# EAGLE design PCB 3.0 (EAGLE 9.6.2)
CNAME: DIY-Thermocam V2; CREVISION: 2.3; DESIGNER: Max Ritter
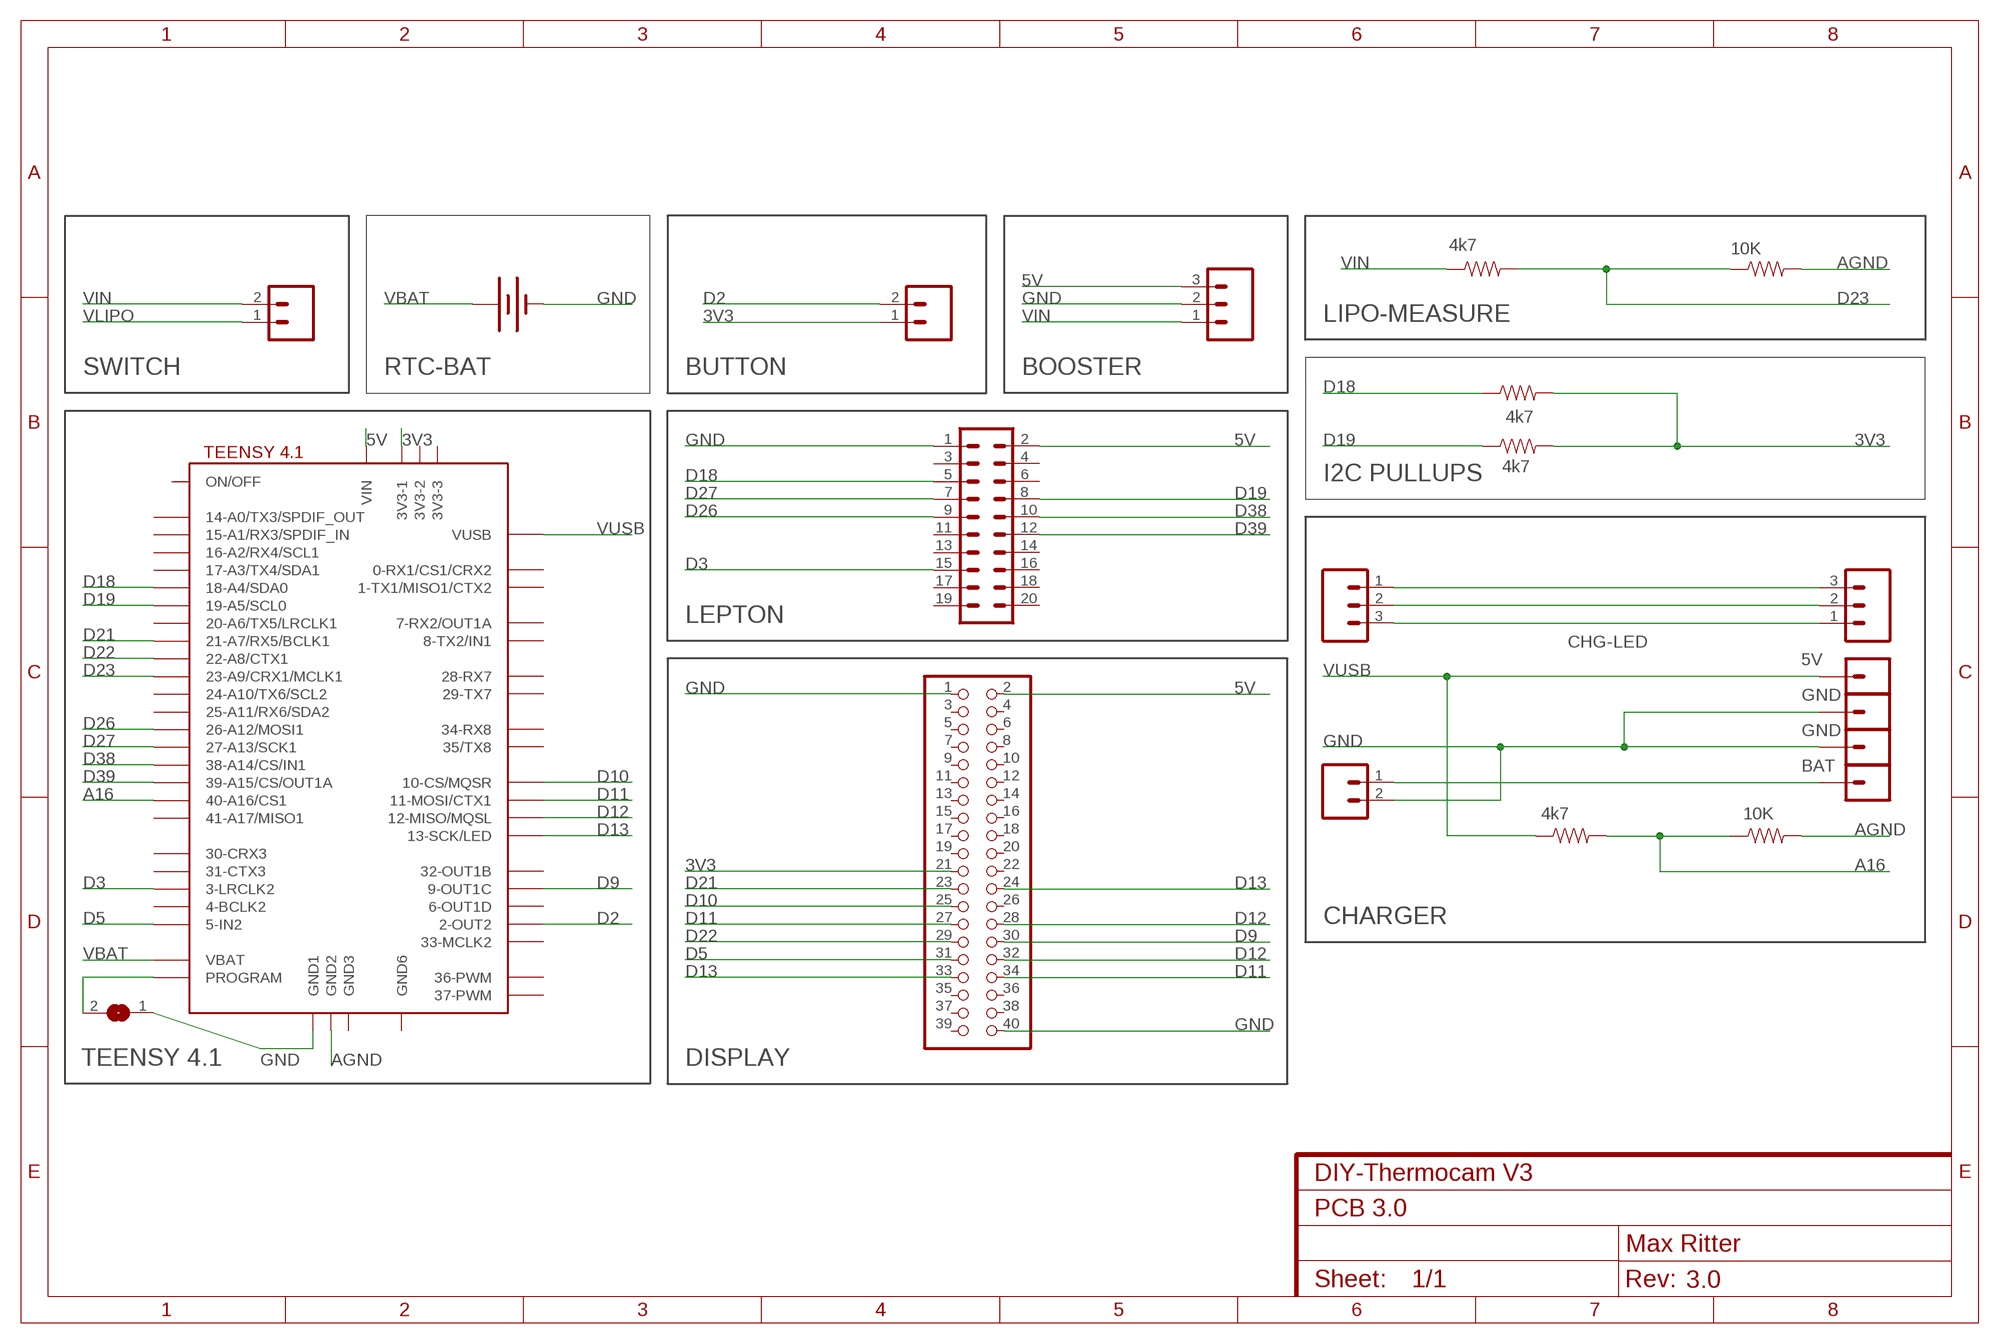
[diagram p0: schematic, sheet 1]
FRAME1 (FRAME-A4L): CNAME: DIY-Thermocam V3; CREVISION: 3.0

## Parts
BAT  BATTERY12PTH  [BATTCON_12MM_PTH]
BOOSTER  M03PTH  [1X03]
BUTTON  M02PTH  [1X02]
BUTTON1  M02PTH  [1X02]
CHG-LED  M03PTH  [1X03]
J2  CONN_10X2NOSILK  [2X10_NOSILK]
JP1  M01PTH  [1X01]
JP2  M01PTH  [1X01]
JP3  M01PTH  [1X01]
JP4  M01PTH  [1X01]
LASER1  M03PTH  [1X03]
LCD-HEADER  PINHD-2X20  [2X20]
PROGRAM  SJ  [SJ]
R1  4k7  RESISTORPTH-1/4W  [AXIAL-0.4]
R2  10K  RESISTORPTH-1/4W  [AXIAL-0.4]
R3  4k7  RESISTORPTH-1/4W  [AXIAL-0.4]
R4  4k7  RESISTORPTH-1/4W  [AXIAL-0.4]
R5  10K  RESISTORPTH-1/4W  [AXIAL-0.4]
R6  4k7  RESISTORPTH-1/4W  [AXIAL-0.4]
SWITCH  M02PTH  [1X02]
U$2  TEENSY41-E  [TENNSY41-E]

## Nets
3V3: BUTTON.1 LCD-HEADER.21 R4.P$2 R6.P$2 U$2.3V3-1
5V: BOOSTER.3 J2.2 LCD-HEADER.2 U$2.VIN
A16: R3.P$2 R5.P$1 U$2.40-A16/CS1
AGND: R2.P$2 R5.P$2 U$2.GND2
D2: BUTTON.2 U$2.2-OUT2
D3: J2.15 U$2.3-LRCLK2
D5: LCD-HEADER.31 U$2.5-IN2
D9: LCD-HEADER.30 U$2.9-OUT1C
D10: LCD-HEADER.25 U$2.10-CS\MQSR(10-CS/MQSR)
D11: LCD-HEADER.27 LCD-HEADER.34 U$2.11-MOSI/CTX1
D12: LCD-HEADER.28 LCD-HEADER.32 U$2.12-MISO/MQSL
D13: LCD-HEADER.24 LCD-HEADER.33 U$2.13-SCK/LED
D18: J2.5 R4.P$1 U$2.18-A4/SDA0
D19: J2.8 R6.P$1 U$2.19-A5/SCL0
D21: LCD-HEADER.23 U$2.21-A7/RX5/BCLK1
D22: LCD-HEADER.29 U$2.22-A8/CTX1
D23: R1.P$2 R2.P$1 U$2.23-A9/CRX1/MCLK1
D26: J2.9 U$2.26-A12/MOSI1
D27: J2.7 U$2.27-A13/SCK1
D38: J2.10 U$2.38-A14/CS/IN1
D39: J2.12 U$2.39-A15/CS/OUT1A
GND: BAT.GND(-) BOOSTER.2 BUTTON1.2 J2.1 JP1.1 JP2.1 LCD-HEADER.1 LCD-HEADER.40 PROGRAM.1 U$2.GND1
N$4: CHG-LED.3 LASER1.1
N$16: CHG-LED.2 LASER1.2
N$18: CHG-LED.1 LASER1.3
N$42: PROGRAM.2 U$2.PROGRAM
VBAT: BAT.VCC@1(+) U$2.VBAT
VIN: BOOSTER.1 R1.P$1 SWITCH.2
VLIPO: BUTTON1.1 JP3.1 SWITCH.1
VUSB: JP4.1 R3.P$1 U$2.VUSB
Unconnected: J2.3 J2.4 J2.6 J2.11 J2.13 J2.14 J2.16 J2.17 J2.18 J2.19 J2.20 LCD-HEADER.3 LCD-HEADER.4 LCD-HEADER.5 LCD-HEADER.6 LCD-HEADER.7 LCD-HEADER.8 LCD-HEADER.9 LCD-HEADER.10 LCD-HEADER.11 LCD-HEADER.12 LCD-HEADER.13 LCD-HEADER.14 LCD-HEADER.15 LCD-HEADER.16 LCD-HEADER.17 LCD-HEADER.18 LCD-HEADER.19 LCD-HEADER.20 LCD-HEADER.22 LCD-HEADER.26 LCD-HEADER.35 LCD-HEADER.36 LCD-HEADER.37 LCD-HEADER.38 LCD-HEADER.39 U$2.0-RX1/CS1/CRX2 U$2.1-TX1/MISO1/CTX2 U$2.3V3-2 U$2.3V3-3 U$2.4-BCLK2 U$2.6-OUT1D U$2.7-RX2/OUT1A U$2.8-TX2/IN1 U$2.14-A0/TX3/SPDIF_OUT U$2.15-A1/RX3/SPDIF_IN U$2.16-A2/RX4/SCL1 U$2.17-A3/TX4/SDA1 U$2.20-A6/TX5/LRCLK1 U$2.24-A10/TX6/SCL2 U$2.25-A11/RX6/SDA2 U$2.28-RX7 U$2.29-TX7 U$2.30-CRX3 U$2.31-CTX3 U$2.32-OUT1B U$2.33-MCLK2 U$2.34-RX8 U$2.35-TX8(35/TX8) U$2.36-PWM U$2.37-PWM U$2.41-A17/MISO1 U$2.GND3 U$2.GND6 U$2.ON/OFF

## Notes on the sheet
- LIPO-MEASURE
- SWITCH | RTC-BAT | BUTTON | BOOSTER
- I2C PULLUPS
- LEPTON
- 5V
- GND
- GND
- BAT
- CHARGER
- TEENSY 4.1 | DISPLAY

## Library data of the parts
BAT = SparkFun-Electromechanical:BATTERY: Battery Holders Various common sizes : AA, AAA, 18650 (PRT-12895), 20mm coin cell and 12mm coin cell. 20MM_4LEGS, BATT-10373
BOOSTER CHG-LED LASER1 = SparkFun-Connectors:M03: Header 3 Standard 3-pin 0.1" header. Use with straight break away headers (SKU : PRT-00116), right angle break away headers (PRT-00553), swiss pins (PRT-00743), machine pins (PRT-00117), and female headers (PRT-00115). Molex polarized connector foot print use with SKU : PRT-08232 with associated crimp pins and housings.
BUTTON BUTTON1 SWITCH = SparkFun-Connectors:M02: Standard 2-pin 0.1" header. Use with - straight break away headers ( PRT-00116) - right angle break away headers (PRT-00553) - swiss pins (PRT-00743) - machine pins (PRT-00117) - female headers (PRT-00115) Molex polarized connector foot print use with: PRT-08233 with associated crimp pins and housings. 2.54_SCREWTERM for use with PRT-10571. 3.5mm Screw Terminal footprints for PRT-08084 5mm Screw Terminal footprints for use with PRT-08432
J2 = SparkFun-Connectors:CONN_10X2: Multi connection point. Often used as Generic Header-pin footprint for 0.1 inch spaced/style header connections On any of the 0.1 inch spaced packages, you can populate with these: Break Away Headers - Straight <https://www.sparkfun.com/products/116> (PRT-00116) Break Away Male Headers - Right Angle <https://www.sparkfun.com/products/553> (PRT-00553) Female Headers <https://www.sparkfun.com/products/115> (PRT-00115) Break Away Headers - Machine Pin <https://www.sparkfun.com/products/117> (PRT-00117) Break Away Female Headers - Swiss Machine Pin <https://www.sparkfun.com/products/743> (PRT-00743) Special note about the "SPECIAL" package: This was SPECIALLY designed to be used with our Graphic LCD Backpack. Be sure you want to use this! It is not only staggered on each line of header holes, but IT IS ALSO offset of the center point of the top and bottom lines by 5 mil. This causes the headers to lock into place on the "standard" footprint on the LCD screen. The extra squares on the tdocu layer are there simply to reference other pins (if you were to actually populate a longer header than ten long - this is what we do with the backpacks).
JP1-JP4 = SparkFun-Connectors:M01: Header 1 Standard 1-pin 0.1" header. Use with straight break away headers (SKU : PRT-00116), right angle break away headers (PRT-00553), swiss pins (PRT-00743), machine pins (PRT-00117), and female headers (PRT-00115).
LCD-HEADER = pinhead:PINHD-2X20: PIN HEADER
PROGRAM = jumper:SJ: SMD solder JUMPER
R1-R6 = SparkFun-Resistors:RESISTOR: Resistor Basic schematic elements and footprints for 0603, 1206, and PTH resistors.
U$2 = teensy:TEENSY41-E

## Board
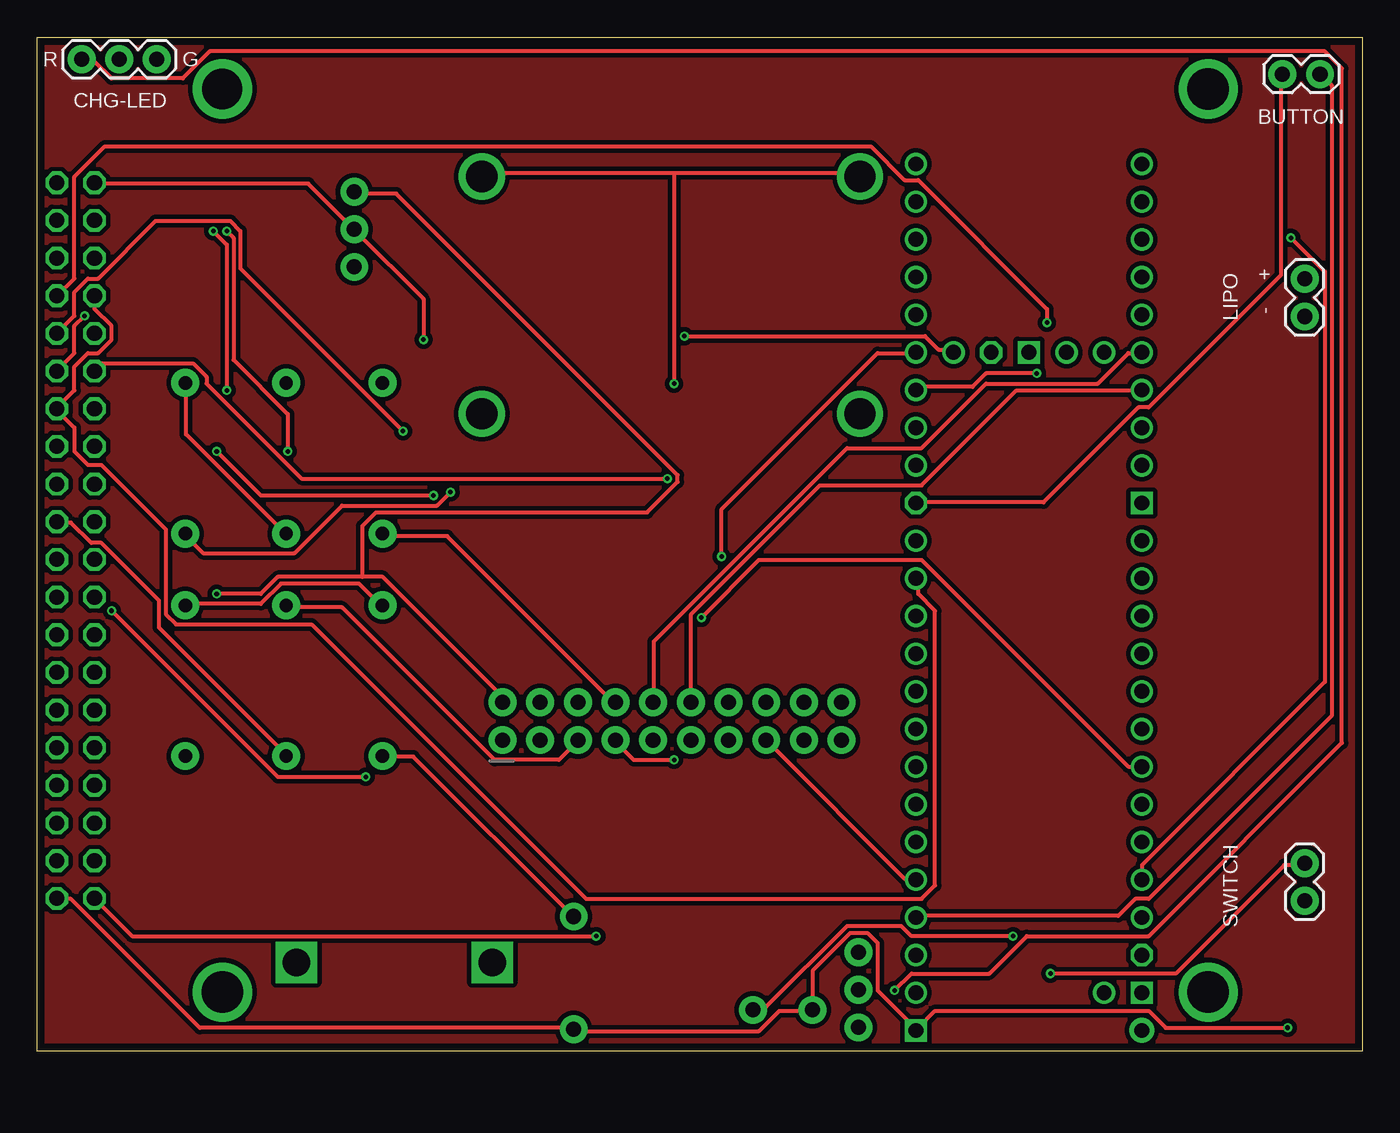
[diagram p1: board, top side]
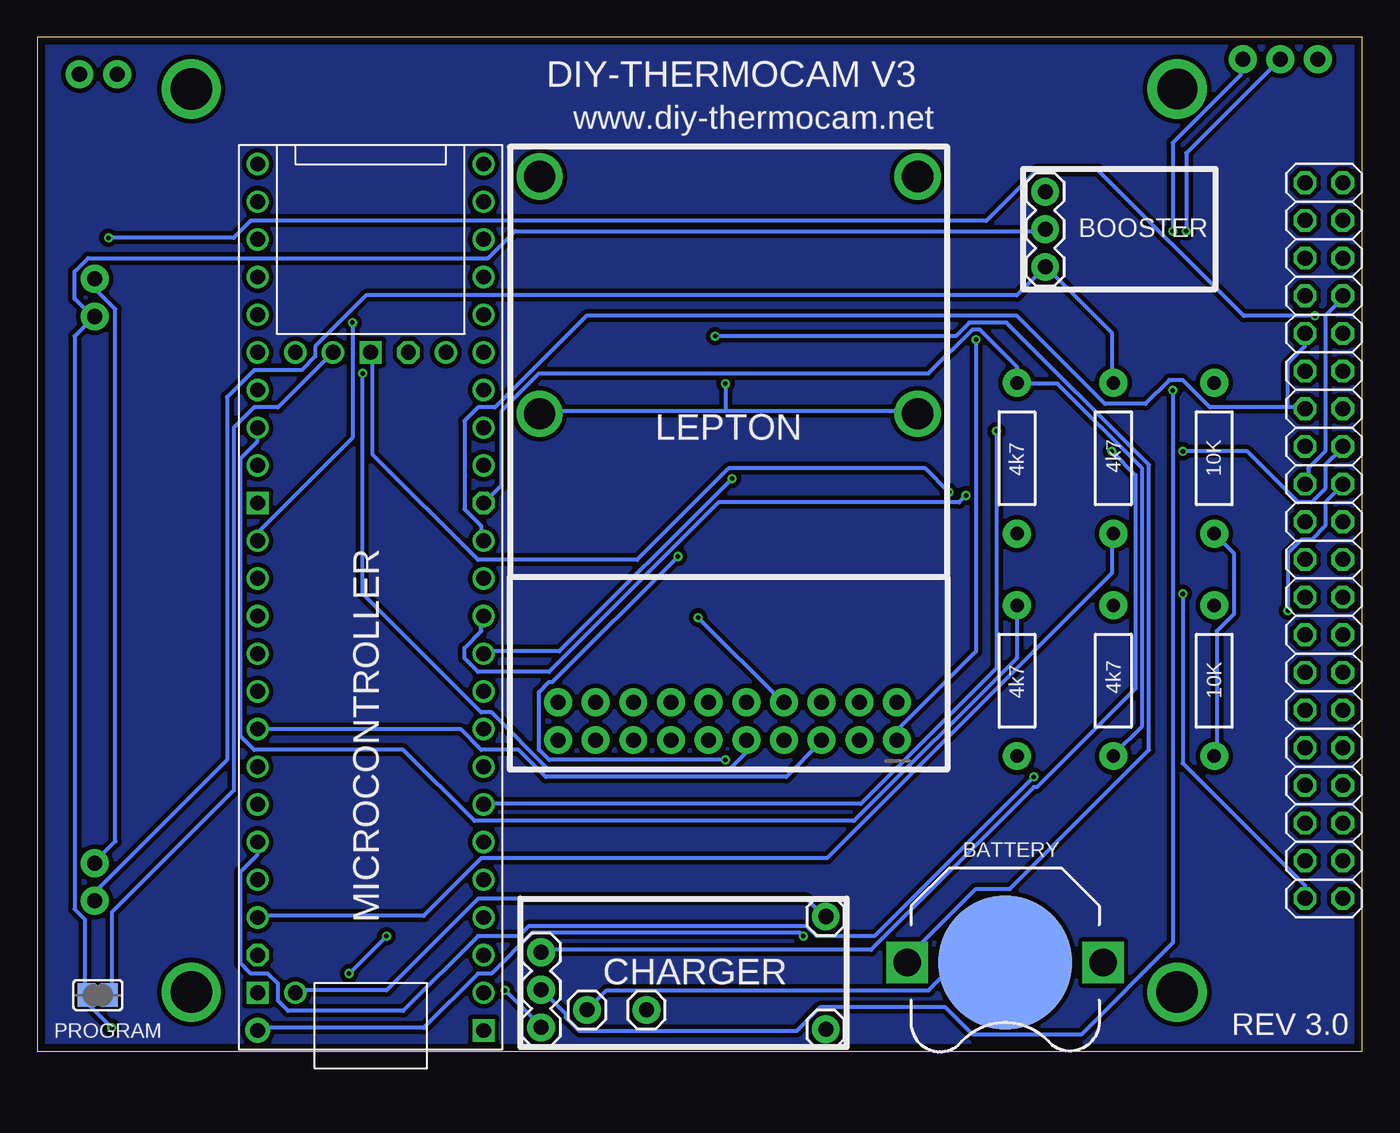
[diagram p2: board, bottom side, seen from below]

Size 89.4 x 68.4 mm. Coordinates in mm from the lower left corner, seen from the top.
Outline: 89.4,0 0,0 0,68.4 89.4,68.4 89.4,0
Copper layers (1*16): Top 0.035mm / dielectric 1.5mm / Bottom 0.035mm
Design rules "NOA Eagle Rule 2016-06-12 *": minimum track width 10mil, minimum drill 12mil, track to track 8mil, track to pad 8mil, pad to pad 8mil, via to via 8mil, smd to smd 0mil, copper to edge 20mil, drill to drill 10mil, minimum pad ring 10mil, minimum via ring 6mil, stop-mask expansion 2mil, vias tented up to drill 25mil, thermal gap 10mil

### Footprints (pad centres in the part's own frame; a part is rotated, then mirrored left to right if it is on the bottom)
BATTCON_12MM_PTH = smd 9 x 9: GND 0,0 | drill 1.854 square: VCC@1 6.604,0; VCC@2 -6.604,0
1X03 = drill 1.016 pad 1.88: 1 0,0; 2 2.54,0; 3 5.08,0
1X02 = drill 1.016 pad 1.88: 1 0,0; 2 2.54,0
2X10_NOSILK = drill 1.016 pad 1.88: 1 0,0; 2 0,2.54; 3 2.54,0; 4 2.54,2.54; 5 5.08,0; 6 5.08,2.54; 7 7.62,0; 8 7.62,2.54; 9 10.16,0; 10 10.16,2.54; 11 12.7,0; 12 12.7,2.54; 13 15.24,0; 14 15.24,2.54; 15 17.78,0; 16 17.78,2.54; 17 20.32,0; 18 20.32,2.54; 19 22.86,0; 20 22.86,2.54
1X01 = drill 1.016 pad 1.88: 1 0,0
2X20 = drill 1.016 octagon: 1 -24.13,-1.27; 2 -24.13,1.27; 3 -21.59,-1.27; 4 -21.59,1.27; 5 -19.05,-1.27; 6 -19.05,1.27; 7 -16.51,-1.27; 8 -16.51,1.27; 9 -13.97,-1.27; 10 -13.97,1.27; 11 -11.43,-1.27; 12 -11.43,1.27; 13 -8.89,-1.27; 14 -8.89,1.27; 15 -6.35,-1.27; 16 -6.35,1.27; 17 -3.81,-1.27; 18 -3.81,1.27; 19 -1.27,-1.27; 20 -1.27,1.27; 21 1.27,-1.27; 22 1.27,1.27; 23 3.81,-1.27; 24 3.81,1.27; 25 6.35,-1.27; 26 6.35,1.27; 27 8.89,-1.27; 28 8.89,1.27; 29 11.43,-1.27; 30 11.43,1.27; 31 13.97,-1.27; 32 13.97,1.27; 33 16.51,-1.27; 34 16.51,1.27; 35 19.05,-1.27; 36 19.05,1.27; 37 21.59,-1.27; 38 21.59,1.27; 39 24.13,-1.27; 40 24.13,1.27
SJ = smd 1.168 x 1.6: 1 -0.762,0; 2 0.762,0
AXIAL-0.4 = drill 0.9 pad 1.88: P$1 -5.08,0; P$2 5.08,0
TENNSY41-E = drill 1: 0-RX1/CS1/CRX2 -27.94,-7.62; 1-TX1/MISO1/CTX2 -25.4,-7.62; 2-OUT2 -22.86,-7.62; 3-LRCLK2 -20.32,-7.62; 4-BCLK2 -17.78,-7.62; 5-IN2 -15.24,-7.62; 6-OUT1D -12.7,-7.62; 7-RX2/OUT1A -10.16,-7.62; 8-TX2/IN1 -7.62,-7.62; 9-OUT1C -5.08,-7.62; 10-CS\MQSR -2.54,-7.62; 11-MOSI/CTX1 0,-7.62; 12-MISO/MQSL 2.54,-7.62; 13-SCK/LED 2.54,7.62; 14-A0/TX3/SPDIF_OUT 0,7.62; 15-A1/RX3/SPDIF_IN -2.54,7.62; 16-A2/RX4/SCL1 -5.08,7.62; 17-A3/TX4/SDA1 -7.62,7.62; 18-A4/SDA0 -10.16,7.62; 19-A5/SCL0 -12.7,7.62; 20-A6/TX5/LRCLK1 -15.24,7.62; 21-A7/RX5/BCLK1 -17.78,7.62; 22-A8/CTX1 -20.32,7.62; 23-A9/CRX1/MCLK1 -22.86,7.62; 24-A10/TX6/SCL2 7.62,-7.62; 25-A11/RX6/SDA2 10.16,-7.62; 26-A12/MOSI1 12.7,-7.62; 27-A13/SCK1 15.24,-7.62; 28-RX7 17.78,-7.62; 29-TX7 20.32,-7.62; 30-CRX3 22.86,-7.62; 31-CTX3 25.4,-7.62; 32-OUT1B 27.94,-7.62; 33-MCLK2 27.94,7.62; 34-RX8 25.4,7.62; 35-TX8 22.86,7.62; 36-PWM 20.32,7.62; 37-PWM 17.78,7.62; 38-A14/CS/IN1 15.24,7.62; 39-A15/CS/OUT1A 12.7,7.62; 40-A16/CS1 10.16,7.62; 41-A17/MISO1 7.62,7.62; ON/OFF 15.24,5.08; PROGRAM 15.24,2.54; VBAT 15.24,-5.08; VUSB -27.94,5.08 | drill 1 octagon: 3V3-1 5.08,-7.62; 3V3-2 15.24,-2.54; 3V3-3 -25.4,7.62 | drill 1 square: GND1 -30.48,-7.62; GND2 15.24,0; GND3 5.08,7.62; GND6 -27.94,7.62 | drill 1 pad 1.676: VIN -30.48,7.62

### Placement (x,y rotation side)
BAT  24.1,6 180 bottom
BOOSTER  21.4,52.9 90 bottom
BUTTON  84,65.9 0 top
BUTTON1  85.5,52.1 270 top
CHG-LED  3,66.9 0 top
J2  31.4,21 0 top
JP1  36.2,1.5 0 bottom
JP2  52.3,2.8 0 bottom
JP3  48.3,2.8 0 bottom
JP4  36.2,9.1 0 bottom
LASER1  55.4,6.7 270 bottom
LCD-HEADER  2.6,34.45 90 bottom
PROGRAM  85.3,3.8 0 bottom
R1  16.8,40 270 bottom
R2  10,40 270 bottom
R3  23.3,25 90 bottom
R4  16.8,25 270 bottom
R5  10,25 270 bottom
R6  23.3,40 90 bottom
SWITCH  85.5,12.7 270 top
U$2  66.9,31.9 90 bottom

### Tracks (layer width: path | path; a pad name or v marks a point on that pad's centre or on a via)
3V3
  Top 0.254: LCD-HEADER.21 1.37,35.66 2.29,35.66 3.66,34.29 4.34,34.29 8.23,30.4 8.23,28.57 16.69,20.12 R4.P$2 | U$2.3V3-1 59.44,37.03 67.89,37.03 74.3,43.43 74.98,43.43 83.9,52.35 83.9,65.84 BUTTON.1
  Bottom 0.254: R4.P$2 16.69,20.12 14.86,21.95 14.86,39.32 20.57,45.03 23.09,45.03 R6.P$2 23.32,45.26 23.32,46.18 25.83,48.69 26.29,48.69 29.26,45.72 55.55,45.72 58.06,43.2 58.06,38.18 59.21,37.03 U$2.3V3-1
5V  (via drill 0.3)
  Top 0.254: v12.12,30.86 15.09,30.86 16.23,32 21.95,32 | 21.95,32 23.32,32 31.32,24 31.32,23.55 J2.2 | v37.72,7.77 6.4,7.77 3.89,10.29 LCD-HEADER.2 | 21.95,32 21.95,35.43 22.86,36.35 41.15,36.35 43.2,38.41 43.2,38.86 24.23,57.84 21.49,57.84 BOOSTER.3
  Bottom 0.254: v12.12,30.86 12.12,19.43 3.89,11.2 3.89,10.52 LCD-HEADER.2 | v37.72,7.77 37.95,8 56.01,8 58.75,5.26 59.66,5.26 63.32,1.6 74.3,1.6 U$2.VIN
A16
  Top 0.254: R5.P$1 10.06,30.18 15.09,30.18 16.46,31.55 21.72,31.55 23.09,30.18 R3.P$2
  Bottom 0.254: U$2.40-A16/CS1 74.52,41.83 74.52,41.15 75.67,40.01 75.67,21.26 74.75,20.34 64.69,20.34 59.89,15.54 34.29,15.54 23.32,26.52 23.32,29.95 R3.P$2
AGND  (via drill 0.3)
  Top 0.254: v27.89,37.72 26.98,36.8 20.57,36.8 17.37,33.6 11.2,33.6 10.06,34.75 R2.P$2
  Bottom 0.254: v27.89,37.72 29.49,39.32 42.75,39.32 48.92,33.15 59.66,33.15 66.75,40.23 66.75,47.09 U$2.GND2 | R5.P$2 9.83,20.12 9.83,28.35 8.69,29.49 8.69,33.6 9.83,34.75 R2.P$2
D2
  Top 0.254: U$2.2-OUT2 59.44,9.14 72.92,9.14 74.07,10.29 74.98,10.29 87.33,22.63 87.33,65.15 86.64,65.84 BUTTON.2
D3
  Top 0.254: U$2.3-LRCLK2 59.21,11.66 58.52,11.66 49.38,20.8 J2.15
D5  (via drill 0.3)
  Top 0.254: v24.69,41.83 13.72,52.81 13.72,55.32 13.03,56.01 8,56.01 4.12,52.12 3.43,52.12 2.52,51.21 2.52,49.61 1.37,48.46 LCD-HEADER.31
  Bottom 0.254: v24.69,41.83 24.69,25.83 33.83,16.69 59.21,16.69 U$2.5-IN2
D9  (via drill 0.3)
  Top 0.254: v42.52,38.63 17.83,38.63 11.43,45.03 11.43,45.49 10.52,46.41 4.34,46.41 3.89,45.95 LCD-HEADER.30
  Bottom 0.254: v42.52,38.63 54.18,26.98 59.21,26.98 U$2.9-OUT1C
D10  (via drill 0.3)
  Top 0.254: v26.75,37.49 15.09,37.49 v12.12,40.46
  Bottom 0.254: v26.75,37.49 27.2,37.03 43.43,37.03 54.86,25.6 59.66,25.6 60.58,26.52 60.58,27.2 59.44,28.35 59.44,29.26 U$2.10-CS\MQSR | v12.12,40.46 7.77,40.46 4.34,37.03 3.43,37.03 2.52,37.95 2.52,39.55 1.37,40.69 LCD-HEADER.25
D11
  Top 0.254: U$2.11-MOSI/CTX1 59.44,31.77 59.44,30.86 60.58,29.72 60.58,11.2 59.66,10.29 37.03,10.29 18.52,28.8 9.37,28.8 8.69,29.49 8.69,35.2 4.34,39.55 3.43,39.55 2.52,40.46 2.52,42.06 1.37,43.2 LCD-HEADER.27 1.37,43.43 2.52,44.58 2.52,46.18 3.43,47.09 4.12,47.09 5.03,48.01 5.03,48.92 3.89,50.06 3.89,50.75 LCD-HEADER.34
D12
  Bottom 0.254: 5.03,43.43 3.89,43.43 LCD-HEADER.28 | 5.03,43.43 10.29,43.43 12.12,45.26 13.03,45.26 14.63,43.66 17.37,43.66 23.32,49.61 52.35,49.61 58.52,43.43 59.66,43.43 60.58,42.52 60.58,36.58 59.44,35.43 59.44,34.52 U$2.12-MISO/MQSL | 5.03,43.43 5.03,46.41 3.89,47.55 3.89,48.23 LCD-HEADER.32
D13  (via drill 0.3)
  Top 0.254: v68.12,49.15 68.12,50.06 59.44,58.75 58.52,58.75 56.24,61.04 4.57,61.04 2.52,58.98 2.52,52.12 1.37,50.98 LCD-HEADER.33
  Bottom 0.254: v68.12,49.15 68.12,41.38 74.3,35.2 74.3,34.52 U$2.13-SCK/LED | LCD-HEADER.24 3.66,38.41 3.66,39.32 2.52,40.46 2.52,49.61 1.37,50.75 LCD-HEADER.33
D18
  Top 0.254: R4.P$1 16.92,29.95 20.57,29.95 30.86,19.66 35.2,19.66 36.35,20.8 J2.5
  Bottom 0.254: U$2.18-A4/SDA0 74.3,21.72 60.81,21.72 59.44,20.34 56.92,20.34 55.09,18.52 38.86,18.52 36.58,20.8 J2.5
D19  (via drill 0.3)
  Top 0.254: v44.81,29.26 48.69,33.15 59.66,33.15 73.61,19.2 74.3,19.2 U$2.19-A5/SCL0 | R6.P$1 23.32,34.75 27.66,34.75 38.86,23.55 J2.8
  Bottom 0.254: v44.81,29.26 39.09,23.55 J2.8
D21  (via drill 0.3)
  Top 0.254: v22.17,18.52 16.23,18.52 v5.03,29.72
  Bottom 0.254: v22.17,18.52 32.92,7.77 36.8,7.77 37.49,8.46 56.24,8.46 56.92,7.77 59.66,7.77 64.69,2.74 72.47,2.74 73.15,3.43 73.15,4.57 73.84,5.26 74.98,5.26 75.67,5.94 75.67,12.12 74.52,13.26 74.52,13.95 U$2.21-A7/RX5/BCLK1 | v5.03,29.72 5.03,33.6 4.12,34.52 3.43,34.52 2.52,35.43 2.52,37.03 1.37,38.18 LCD-HEADER.23
D22  (via drill 0.3)
  Top 0.254: v84.58,54.86 86.87,52.58 86.87,24.92 74.52,12.57 74.52,11.66 U$2.22-A8/CTX1 | v3.2,49.61 2.52,48.92 2.52,47.09 1.37,45.95 LCD-HEADER.29
  Bottom 0.254: v84.58,54.86 76.12,54.86 74.98,56.01 25.38,56.01 21.95,59.44 17.83,59.44 8,49.61 v3.2,49.61
D23
  Top 0.254: R2.P$1 10.06,45.03 10.06,41.6 16.69,34.98 R1.P$2
  Bottom 0.254: U$2.23-A9/CRX1/MCLK1 74.3,9.14 63.32,9.14 59.44,13.03 36.12,13.03 16.92,32.23 16.92,34.75 R1.P$2
D26  (via drill 0.3)
  Top 0.254: v67.44,45.72 64.01,45.72 63.09,44.81 59.44,44.81 U$2.26-A12/MOSI1
  Bottom 0.254: v67.44,45.72 67.44,30.86 59.44,22.86 58.75,22.86 54.86,18.97 42.75,18.97 41.6,20.12 41.6,20.8 J2.9
D27  (via drill 0.3)
  Top 0.254: v46.18,33.38 46.18,36.58 56.69,47.09 59.21,47.09 U$2.27-A13/SCK1 | v42.98,19.66 40.23,19.66 39.09,20.8 J2.7
  Bottom 0.254: v46.18,33.38 54.63,24.92 54.86,24.92 55.55,24.23 55.55,20.34 54.86,19.66 v42.98,19.66
D38
  Top 0.254: U$2.38-A14/CS/IN1 74.3,47.09 73.61,47.09 71.55,45.03 64.01,45.03 59.66,40.69 54.63,40.69 41.6,27.66 41.6,23.55 J2.10
D39
  Top 0.254: U$2.39-A15/CS/OUT1A 74.3,44.58 66.06,44.58 59.66,38.18 52.81,38.18 44.12,29.49 44.12,23.55 J2.12
GND  (via drill 0.3)
  Top 0.254: LCD-HEADER.40 3.89,58.52 18.29,58.52 21.26,55.55 BOOSTER.2 21.49,55.32 26.06,50.75 v26.06,48.01 | LCD-HEADER.1 1.37,10.29 2.29,10.29 10.97,1.6 36.12,1.6 JP1.1 36.35,1.37 48.69,1.37 50.06,2.74 52.12,2.74 JP2.1 52.35,2.97 52.35,5.49 54.86,8 56.01,8 56.69,7.32 56.69,4.12 59.21,1.6 U$2.GND1 59.44,1.6 60.58,2.74 74.98,2.74 76.12,1.6 v84.35,1.6
  Bottom 0.254: v26.06,48.01 26.06,26.98 31.32,21.72 31.32,21.03 J2.1 | BAT.GND 24.23,5.94 27.43,5.94 29.26,4.12 50.98,4.12 52.12,2.97 JP2.1 | v84.35,1.6 85.95,3.2 85.95,3.66 PROGRAM.1 86.18,3.89 86.18,8.91 86.87,9.6 86.87,48.23 85.72,49.38 BUTTON1.2 85.72,49.61 86.87,50.75 86.87,52.58 85.95,53.49 58.98,53.49 57.15,55.32 21.49,55.32 BOOSTER.2
N$1  (via drill 2.7 pad 4)
  other vias: 12.5,64.9
N$2
  pour Top (isolate 0.305): 0,0 89.4,0 89.4,68.4 0,68.4
N$3
  pour Bottom (isolate 0.305): 0,0 89.4,0 89.4,68.4 0,68.4
N$4  (via drill 0.3)
  Top 0.254: v16.92,40.46 16.92,42.98 13.26,46.63 13.26,54.86 v12.8,55.32
  Bottom 0.254: v16.92,40.46 15.32,38.86 15.32,24.46 21.95,17.83 22.17,17.83 33.15,6.86 55.32,6.86 LASER1.1 | v12.8,55.32 12.8,61.27 8.23,65.84 8.23,66.75 CHG-LED.3
N$5  (via drill 2.8 pad 4)
  other vias: 79,64.9
N$6  (via drill 2.8 pad 4)
  other vias: 12.5,4
N$7  (via drill 2.8 pad 4)
  other vias: 79,4
N$8  (via drill 0.3, 2.1 pad 3.12)
  Top 0.254: 42.98,59.21 55.32,59.21 v55.5,59 | 42.98,59.21 30.18,59.21 v30,59 | 42.98,59.21 v42.98,45.03
  Bottom 0.254: 42.98,43.2 55.32,43.2 v55.5,43 | 42.98,43.2 30.18,43.2 v30,43 | v42.98,45.03 42.98,43.2
N$16  (via drill 0.3)
  Top 0.254: v12.8,44.58 12.8,54.41 v11.89,55.32
  Bottom 0.254: v12.8,44.58 12.8,7.32 18.97,1.14 26.29,1.14 28.12,2.97 36.58,2.97 38.18,1.37 52.81,1.37 53.72,2.29 53.72,2.52 55.32,4.12 LASER1.2 | v11.89,55.32 11.89,60.58 5.71,66.75 CHG-LED.2
N$18  (via drill 0.3)
  Top 0.254: v57.84,4.12 58.98,5.26 64.24,5.26 66.75,7.77 74.98,7.77 88.01,20.8 88.01,66.29 86.87,67.44 11.66,67.44 9.83,65.61 5.03,65.61 3.89,66.75 3.2,66.75 CHG-LED.1
  Bottom 0.254: v57.84,4.12 55.55,1.83 LASER1.3
N$42
  Bottom 0.254: PROGRAM.2 84.35,3.89 84.35,9.37 76.12,17.6 76.12,42.06 74.75,43.43 73.15,43.43 69.49,47.09 U$2.PROGRAM
VBAT  (via drill 0.3)
  Top 0.254: v43.66,48.23 59.89,48.23 60.81,47.32 61.72,47.32 U$2.VBAT
  Bottom 0.254: v43.66,48.23 27.43,48.23 26.52,49.15 24,49.15 14.4,39.55 14.4,20.34 23.77,10.97 26.06,10.97 30.86,6.17 BAT.VCC@1
VIN
  Bottom 0.254: R1.P$1 16.92,45.26 16.92,48.46 21.26,52.81 BOOSTER.1 21.49,52.81 23.32,50.98 67.21,50.98 70.64,47.55 70.64,46.86 71.55,45.95 74.75,45.95 76.58,44.12 76.58,19.66 85.5,10.74 85.5,10.29 SWITCH.2
VLIPO  (via drill 0.3)
  Top 0.254: v65.84,7.77 58.98,7.77 58.29,8.46 54.63,8.46 49.15,2.97 48.46,2.97 JP3.1 | v68.35,5.26 76.81,5.26 84.12,12.57 85.5,12.57 SWITCH.1
  Bottom 0.254: v68.35,5.26 v65.84,7.77 | BUTTON1.1 85.5,51.89 85.5,51.44 84.12,50.06 84.12,14.17 85.5,12.8 SWITCH.1
VUSB
  Top 0.254: R3.P$1 23.32,19.89 25.38,19.89 36.12,9.14 JP4.1
  Bottom 0.254: U$2.VUSB 71.78,4.12 65.84,4.12 59.66,10.29 37.49,10.29 36.35,9.14 JP4.1

### Text on the board
tPlace: R | G | + | LIPO | -
bPlace: DIY-THERMOCAM V3 | www.diy-thermocam.net | BOOSTER | LEPTON | MICROCONTROLLER | BATTERY | CHARGER | REV 3.0 | PROGRAM